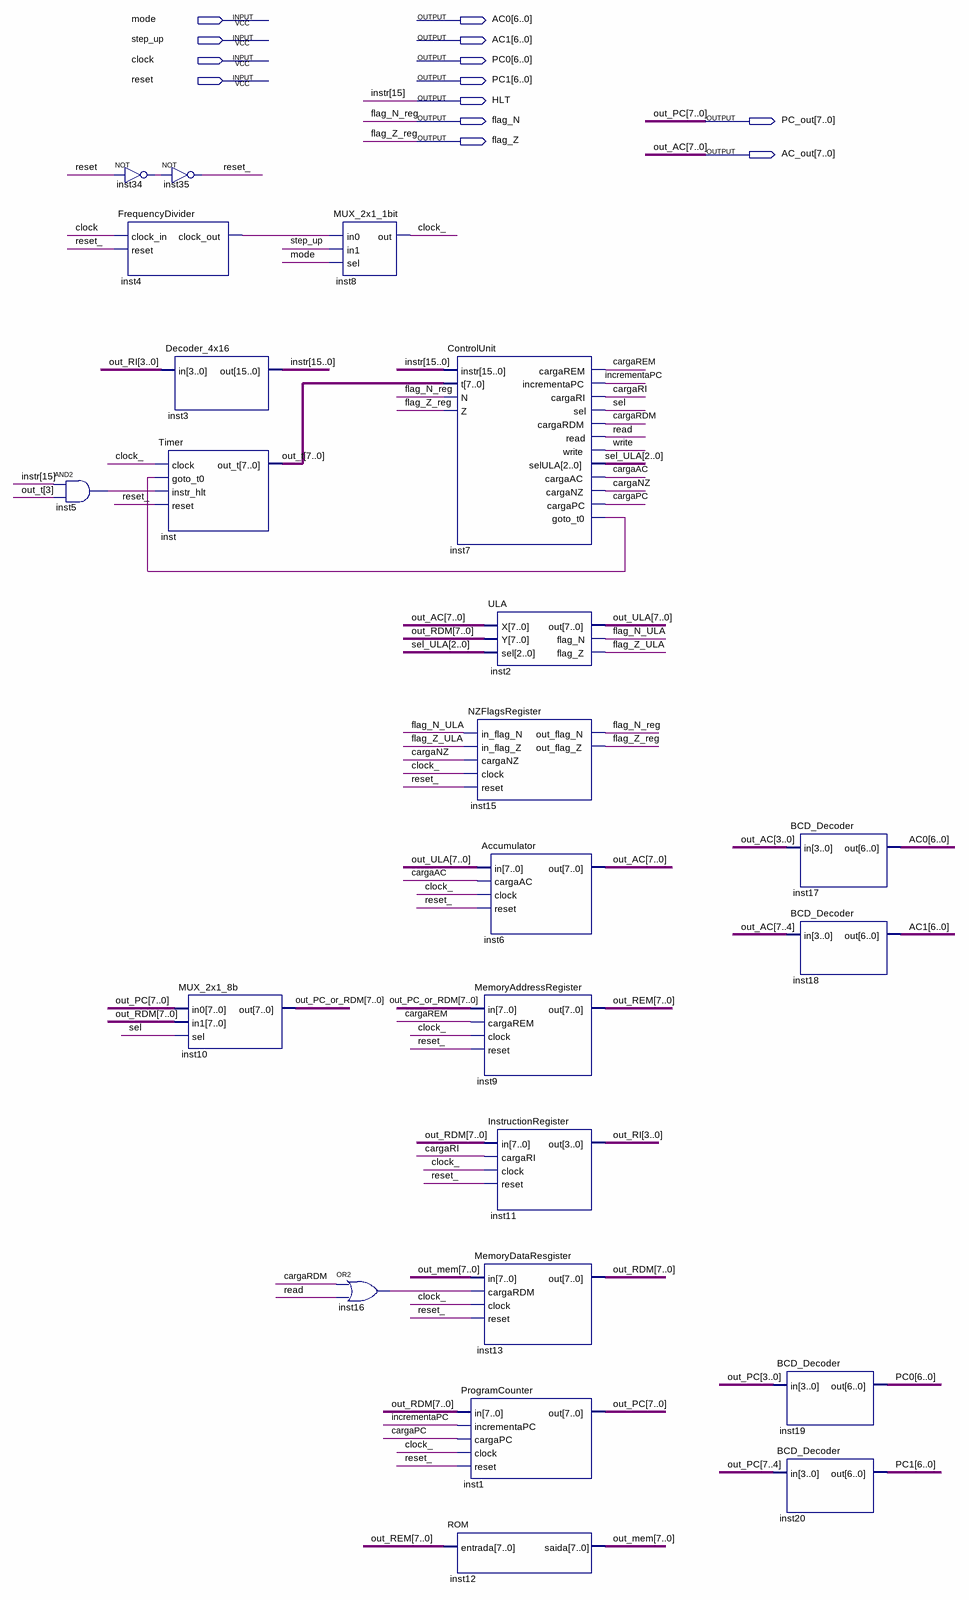
[diagram p0: schematic sheet]
// Quartus schematic Neander.bdf as structural Verilog: 22 symbols, 13 pins
module Neander (
  input  mode,
  input  step_up,
  input  clock,
  input  reset,
  output [6:0] AC0,
  output [6:0] AC1,
  output [6:0] PC0,
  output [6:0] PC1,
  output HLT,
  output flag_N,
  output [7:0] PC_out,
  output flag_Z,
  output [7:0] AC_out
);

  wire cargaAC, cargaNZ, cargaPC, cargaRDM, cargaREM, cargaRI, clock_, flag_N_ULA, flag_Z_ULA, incrementaPC,
       inst4_clock_out, inst5_out, inst7_goto_t0, inst16_out, inst34_out, read, reset_, sel, write;
  wire [2:0] sel_ULA;
  wire [3:0] out_RI;
  wire [7:0] out_mem, out_PC_or_RDM, out_RDM, out_REM, out_t, out_ULA;
  wire [14:0] instr;

  and inst5 (inst5_out, HLT, out_t[3]);
  not inst34 (inst34_out, reset);
  FrequencyDivider inst4 (.clock_in(clock), .reset(reset_), .clock_out(inst4_clock_out));
  not inst35 (reset_, inst34_out);
  Decoder_4x16 inst3 (.in(out_RI), .out({HLT, instr}));
  Timer inst (.clock(clock_), .goto_t0(inst7_goto_t0), .instr_hlt(inst5_out), .reset(reset_), .out_t(out_t));
  MUX_2x1_8b inst10 (.in0(PC_out), .in1(out_RDM), .sel(sel), .out(out_PC_or_RDM));
  MUX_2x1_1bit inst8 (.in0(inst4_clock_out), .in1(step_up), .sel(mode), .out(clock_));
  or inst16 (inst16_out, cargaRDM, read);
  ControlUnit inst7 (
    .instr({HLT, instr}), .t(out_t), .N(flag_N), .Z(flag_Z), .cargaREM(cargaREM),
    .incrementaPC(incrementaPC), .cargaRI(cargaRI), .sel(sel), .cargaRDM(cargaRDM), .read(read),
    .write(write), .selULA(sel_ULA), .cargaAC(cargaAC), .cargaNZ(cargaNZ), .cargaPC(cargaPC),
    .goto_t0(inst7_goto_t0));
  ULA inst2 (.X(AC_out), .Y(out_RDM), .sel(sel_ULA), .out(out_ULA), .flag_N(flag_N_ULA), .flag_Z(flag_Z_ULA));
  NZFlagsRegister inst15 (
    .in_flag_N(flag_N_ULA), .in_flag_Z(flag_Z_ULA), .cargaNZ(cargaNZ), .clock(clock_), .reset(reset_),
    .out_flag_N(flag_N), .out_flag_Z(flag_Z));
  Accumulator inst6 (.in(out_ULA), .cargaAC(cargaAC), .clock(clock_), .reset(reset_), .out(AC_out));
  MemoryAddressRegister inst9 (.in(out_PC_or_RDM), .cargaREM(cargaREM), .clock(clock_), .reset(reset_), .out(out_REM));
  InstructionRegister inst11 (.in(out_RDM), .cargaRI(cargaRI), .clock(clock_), .reset(reset_), .out(out_RI));
  MemoryDataResgister inst13 (.in(out_mem), .cargaRDM(inst16_out), .clock(clock_), .reset(reset_), .out(out_RDM));
  ProgramCounter inst1 (
    .in(out_RDM), .incrementaPC(incrementaPC), .cargaPC(cargaPC), .clock(clock_), .reset(reset_), .out(PC_out));
  ROM inst12 (.entrada(out_REM), .saida(out_mem));
  BCD_Decoder inst17 (.in(AC_out[3:0]), .out(AC0));
  BCD_Decoder inst18 (.in(AC_out[7:4]), .out(AC1));
  BCD_Decoder inst19 (.in(PC_out[3:0]), .out(PC0));
  BCD_Decoder inst20 (.in(PC_out[7:4]), .out(PC1));

  // Other names for the same wires on the sheet: flag_N_reg = flag_N; flag_Z_reg = flag_Z; instr[15] = HLT;
  //   out_AC[7:0] = AC_out; out_PC[7:0] = PC_out
endmodule
